# EAGLE design Shied Array Sensor (EAGLE 8.6.3)
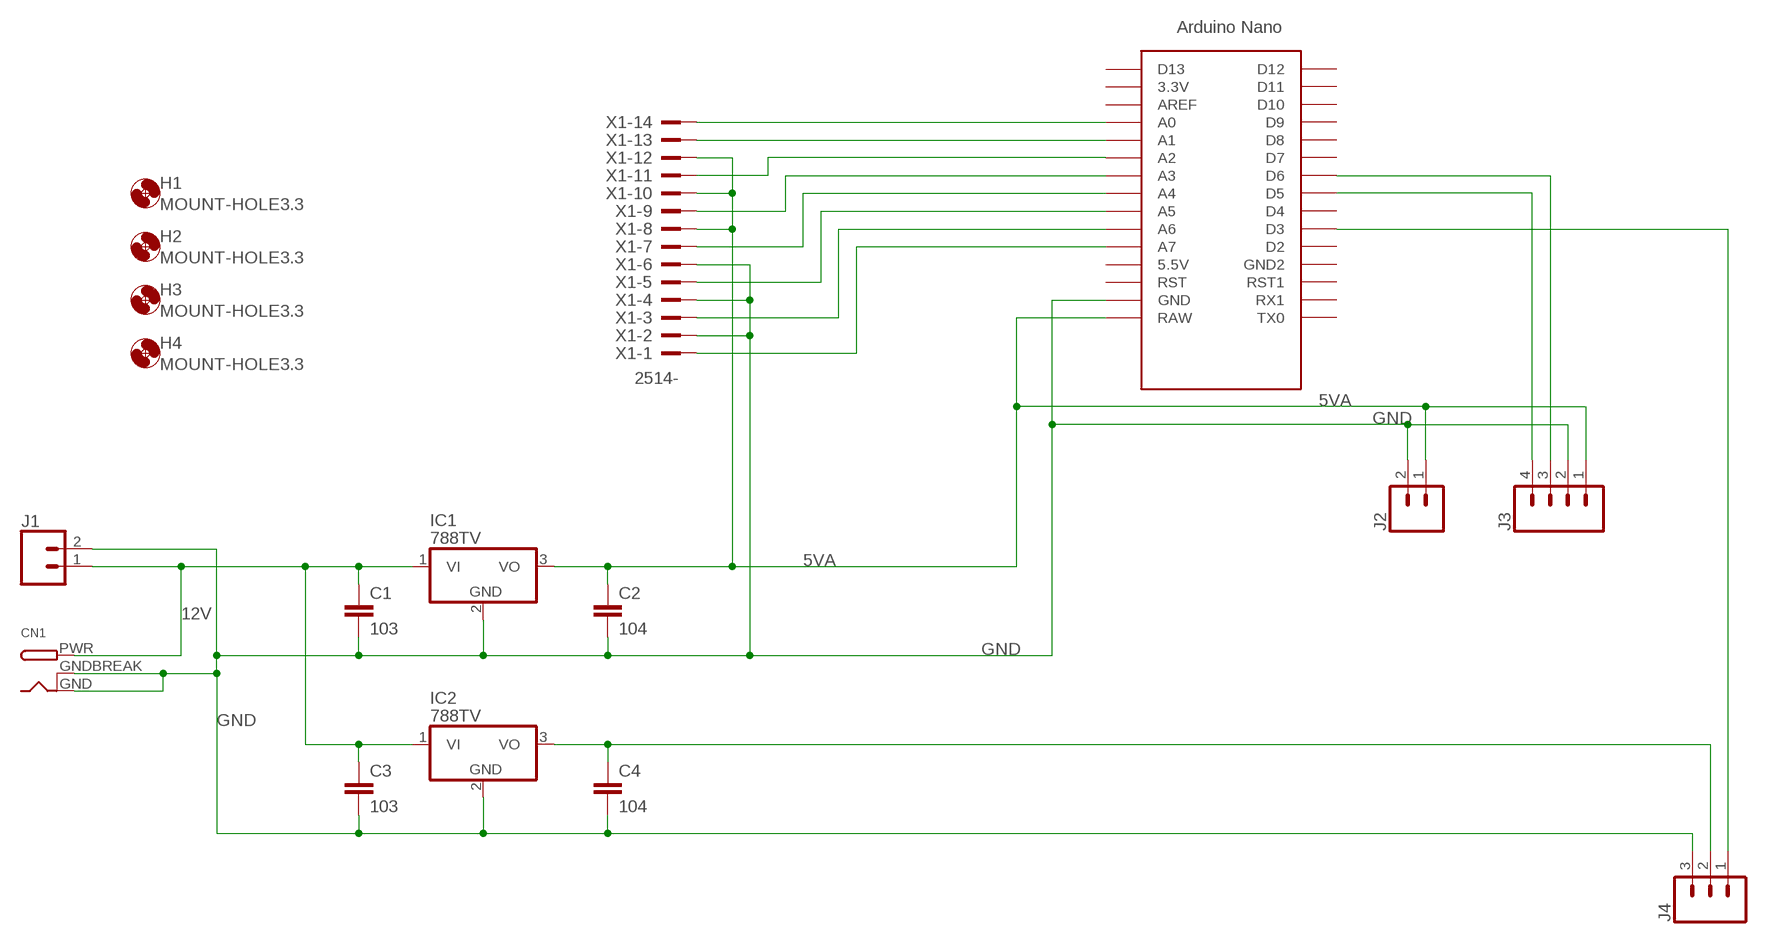
[diagram p0: schematic, sheet 1]

## Parts
C1  103  C-EU050-024X044  [C050-024X044]
C2  104  C-EU050-024X044  [C050-024X044]
C3  103  C-EU050-024X044  [C050-024X044]
C4  104  C-EU050-024X044  [C050-024X044]
CN1  DCBARRELPTH  [DCJACK_2MM_PTH]
H1  MOUNT-HOLE3.3  [3,3]
H2  MOUNT-HOLE3.3  [3,3]
H3  MOUNT-HOLE3.3  [3,3]
H4  MOUNT-HOLE3.3  [3,3]
IC1  788TV  [TO220V]
IC2  788TV  [TO220V]
J1  CONN_023.5MM_LOCK  [SCREWTERMINAL-3.5MM-2_LOCK]
J2  CONN_023.5MM_LOCK  [SCREWTERMINAL-3.5MM-2_LOCK]
J3  CONN_04LONGPADS  [1X04_LONGPADS]
J4  CONN_03LONGPADS  [1X03_LONGPADS]
U$1  NANO  [NANO]
X1  2514-  [PAK100/2500-14]

## Nets
5VA: C2.1 IC1.3(VO) J2.1 J3.1 U$1.RAW X1.8 X1.10 X1.12
12V: C1.1 C3.1 CN1.PWR IC1.1(VI) IC2.1(VI) J1.1
GND: C1.2 C2.2 C3.2 C4.2 CN1.GND CN1.GNDBREAK IC1.2(GND) IC2.2(GND) J1.2 J2.2 J3.2 J4.3 U$1.GND X1.2 X1.4 X1.6
N$1: U$1.A0 X1.14
N$2: U$1.A1 X1.13
N$3: U$1.A2 X1.11
N$4: U$1.A3 X1.9
N$5: U$1.A4 X1.7
N$6: U$1.A5 X1.5
N$7: U$1.A6 X1.3
N$8: U$1.A7 X1.1
N$9: J3.4 U$1.D5
N$10: C4.1 IC2.3(VO) J4.2
N$11: J3.3 U$1.D6
N$13: J4.1 U$1.D3
Unconnected: U$1.3.3V U$1.5V(5.5V) U$1.AREF U$1.D2 U$1.D4 U$1.D7 U$1.D8 U$1.D9 U$1.D10 U$1.D11 U$1.D12 U$1.D13 U$1.GND1(GND2) U$1.ICSP1 U$1.ICSP2 U$1.ICSP3 U$1.ICSP4 U$1.ICSP5 U$1.ICSP6 U$1.RST U$1.RST1 U$1.RX1 U$1.TX0

## Library data of the parts
C1-C4 = rcl:C-EU: CAPACITOR, European symbol; SPICEPREFIX: C
CN1 = adafruit:DCBARREL: 2.0mm DC Barrel Jack DCJACK_2MM_PTH - Through Hole Jack (4UConnector: 05537)
H1-H4 = holes:MOUNT-HOLE: MOUNTING HOLE with drill center marker
IC1 IC2 = linear:78*: Positive VOLTAGE REGULATOR Source: http://cache.national.com/ds/LM/LM78L05.pdf http://www.fairchildsemi.com/ds/LM/LM7805.pdf
J1 J2 = SparkFun-Connectors:CONN_02: Multi connection point. Often used as Generic Header-pin footprint for 0.1 inch spaced/style header connections On any of the 0.1 inch spaced packages, you can populate with these: Break Away Headers - Straight <https://www.sparkfun.com/products/116> (PRT-00116) Break Away Male Headers - Right Angle <https://www.sparkfun.com/products/553> (PRT-00553) Female Headers <https://www.sparkfun.com/products/115> (PRT-00115) Break Away Headers - Machine Pin <https://www.sparkfun.com/products/117> (PRT-00117) Break Away Female Headers - Swiss Machine Pin <https://www.sparkfun.com/products/743> (PRT-00743) For SCREWTERMINALS and SPRING TERMINALS visit here: Screw Terimnals on SparkFun.com <https://www.sparkfun.com/search/results?term=Screw+Terminals> (5mm/3.5mm/2.54mm spacing) This device is also useful as a general connection point to wire up your design to another part of your project. Our various solder wires solder well into these plated through hole pads. Hook-Up Wire - Assortment (Stranded, 22 AWG) <https://www.sparkfun.com/products/11375> (PRT-11375) Hook-Up Wire - Assortment (Solid Core, 22 AWG) <https://www.sparkfun.com/products/11367> (PRT-11367) View the entire wire category on our website here <https://www.sparkfun.com/categories/141> Special notes: Molex polarized connector foot print use with: PRT-08233 with associated crimp pins and housings. 2.54_SCREWTERM for use with PRT-10571. 3.5mm Screw Terminal footprints for PRT-08084 5mm Screw Terminal footprints for use with PRT-08432; PROD_ID: CONN-08399
J3 = SparkFun-Connectors:CONN_04: Multi connection point. Often used as Generic Header-pin footprint for 0.1 inch spaced/style header connections On any of the 0.1 inch spaced packages, you can populate with these: Break Away Headers - Straight <https://www.sparkfun.com/products/116> (PRT-00116) Break Away Male Headers - Right Angle <https://www.sparkfun.com/products/553> (PRT-00553) Female Headers <https://www.sparkfun.com/products/115> (PRT-00115) Break Away Headers - Machine Pin <https://www.sparkfun.com/products/117> (PRT-00117) Break Away Female Headers - Swiss Machine Pin <https://www.sparkfun.com/products/743> (PRT-00743) For SCREWTERMINALS and SPRING TERMINALS visit here: Screw Terimnals on SparkFun.com <https://www.sparkfun.com/search/results?term=Screw+Terminals> (5mm/3.5mm/2.54mm spacing) This device is also useful as a general connection point to wire up your design to another part of your project. Our various solder wires solder well into these plated through hole pads. Hook-Up Wire - Assortment (Stranded, 22 AWG) <https://www.sparkfun.com/products/11375> (PRT-11375) Hook-Up Wire - Assortment (Solid Core, 22 AWG) <https://www.sparkfun.com/products/11367> (PRT-11367) View the entire wire category on our website here <https://www.sparkfun.com/categories/141> Special notes: Molex polarized connector foot print use with SKU : PRT-08231 with associated crimp pins and housings. 1MM SMD Version SKU: PRT-10208; PROD_ID: CONN-09696
J4 = SparkFun-Connectors:CONN_03: Multi connection point. Often used as Generic Header-pin footprint for 0.1 inch spaced/style header connections On any of the 0.1 inch spaced packages, you can populate with these: Break Away Headers - Straight <https://www.sparkfun.com/products/116> (PRT-00116) Break Away Male Headers - Right Angle <https://www.sparkfun.com/products/553> (PRT-00553) Female Headers <https://www.sparkfun.com/products/115> (PRT-00115) Break Away Headers - Machine Pin <https://www.sparkfun.com/products/117> (PRT-00117) Break Away Female Headers - Swiss Machine Pin <https://www.sparkfun.com/products/743> (PRT-00743) Stackable Header - 3 Pin (Female, 0.1") <https://www.sparkfun.com/products/13875> (PRT-13875) For SCREWTERMINALS and SPRING TERMINALS visit here: Screw Terimnals on SparkFun.com <https://www.sparkfun.com/search/results?term=Screw+Terminals> (5mm/3.5mm/2.54mm spacing) This device is also useful as a general connection point to wire up your design to another part of your project. Our various solder wires solder well into these plated through hole pads. Hook-Up Wire - Assortment (Stranded, 22 AWG) <https://www.sparkfun.com/products/11375> (PRT-11375) Hook-Up Wire - Assortment (Solid Core, 22 AWG) <https://www.sparkfun.com/products/11367> (PRT-11367) View the entire wire category on our website here <https://www.sparkfun.com/categories/141> Special notes: Molex polarized connector foot print use with SKU : PRT-08232 with associated crimp pins and housings.
U$1 = Arduino-clone:NANO: Arduino Nano
X1 = con-3m:2514-: 3M (TM) Pak 100 4-Wall Header Source: 3M; OC_FARNELL: unknown; OC_NEWARK: unknown

## Board
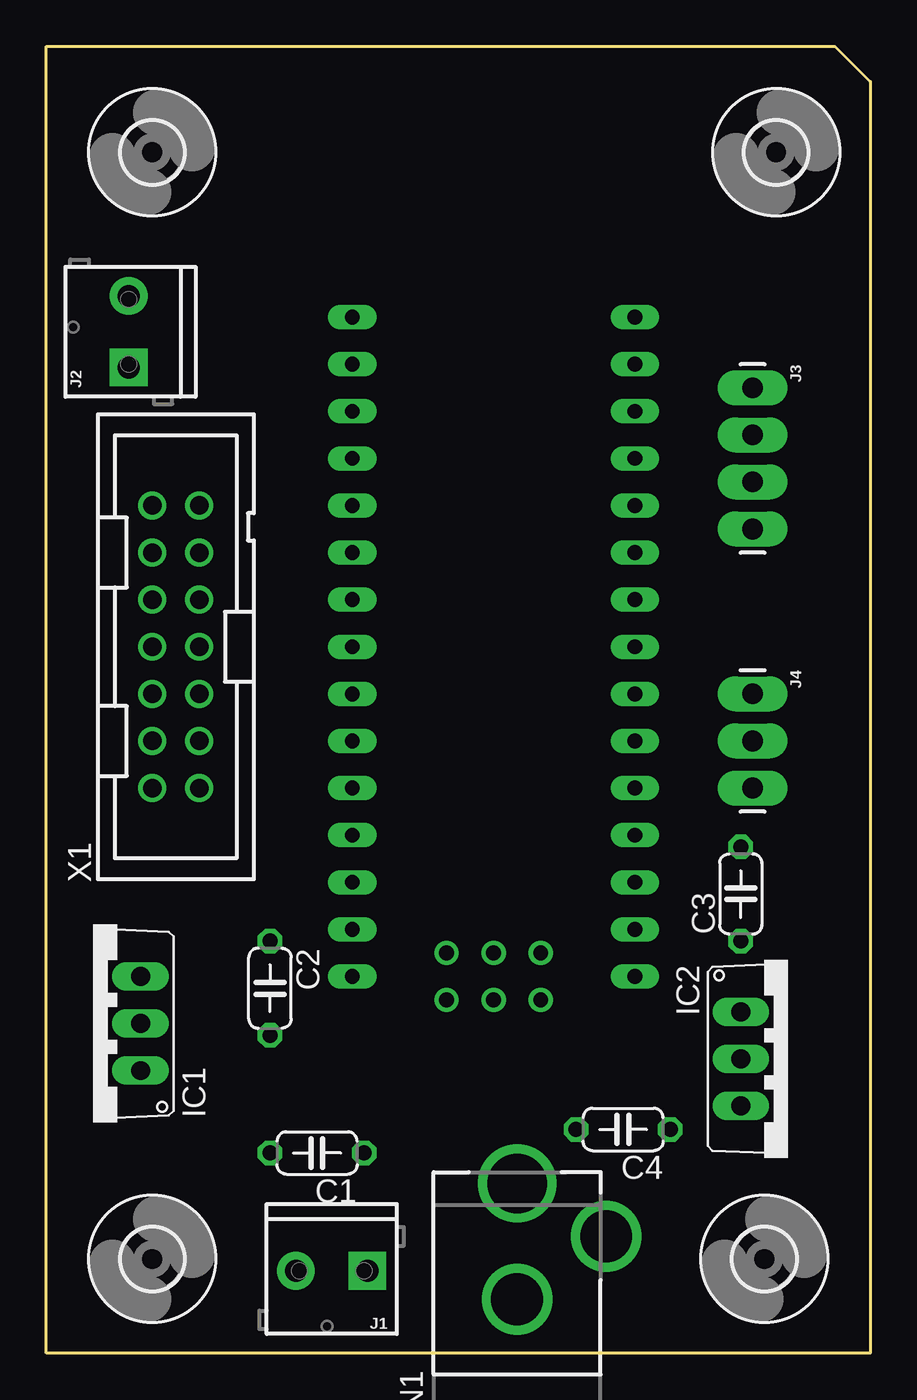
[diagram p1: board, top side]
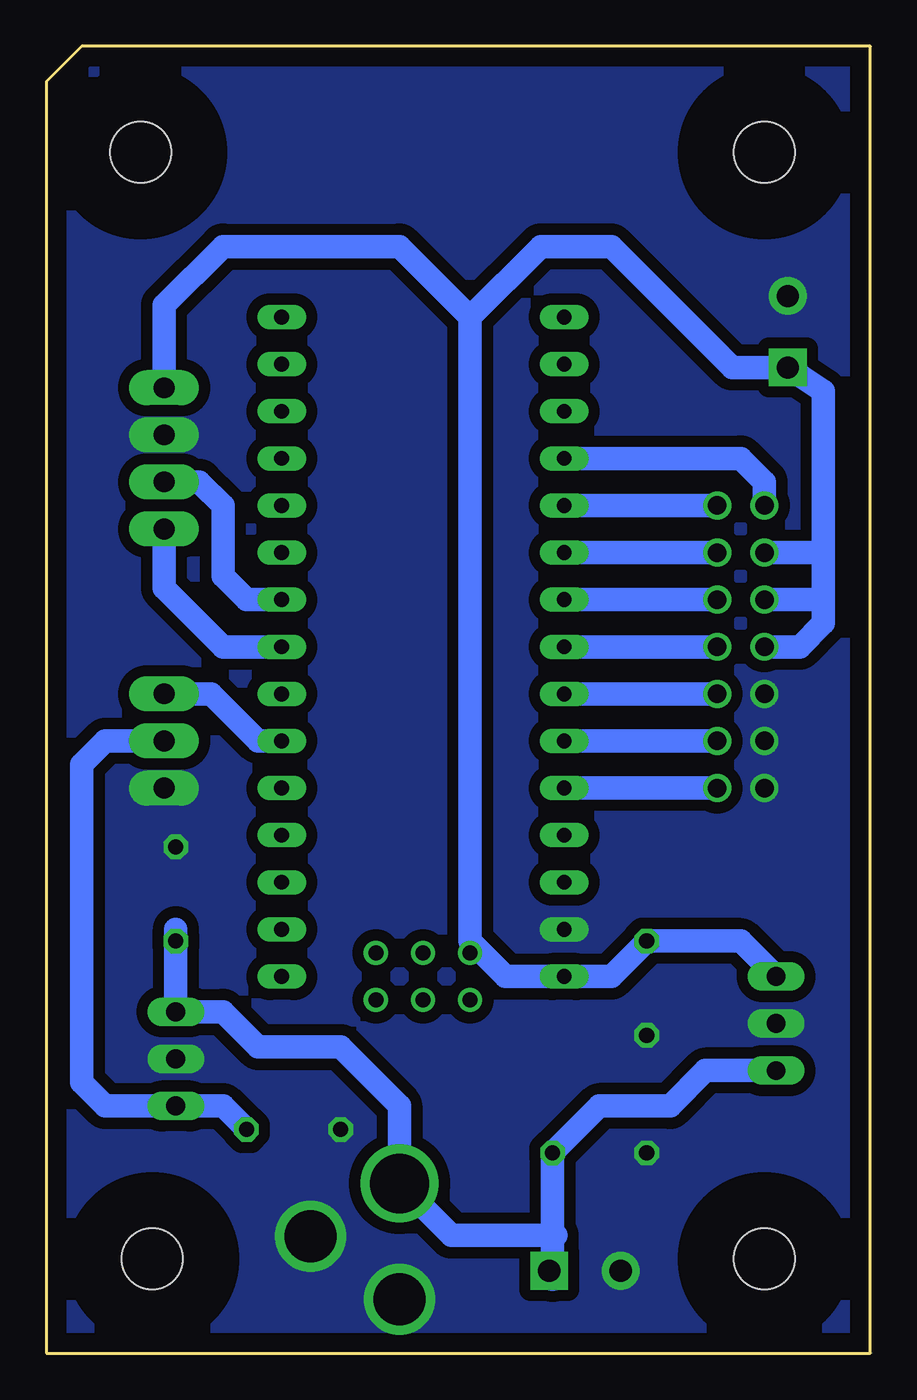
[diagram p2: board, bottom side, seen from below]

Size 44.45 x 70.48 mm. Coordinates in mm from the lower left corner, seen from the top.
Outline: 0,0 0,70.48 42.54,70.48 44.45,68.58 44.45,0 0,0
Copper layers (1*16): Top 0.035mm / dielectric 1.5mm / Bottom 0.035mm
Design rules "default": minimum track width 6mil, minimum drill 0.35mm, track to track 6mil, track to pad 6mil, pad to pad 6mil, via to via 6mil, smd to smd 6mil, copper to edge 40mil, drill to drill 6mil, minimum pad ring 10mil, minimum via ring 8mil, stop-mask expansion 4mil, vias tented up to drill 0mil, thermal gap 10mil

### Footprints (pad centres in the part's own frame; a part is rotated, then mirrored left to right if it is on the bottom)
C050-024X044 = drill 0.813 octagon: 1 -2.54,0; 2 2.54,0
DCJACK_2MM_PTH = drill 2.8: GND 0,7.35; GNDBREAK 4.8,10.75 | drill 3.2: PWR 0,13.6
3,3 = hole 3.3: 0,0
TO220V = drill 1.016 long: 1 -2.54,-2.54; 2 0,-2.54; 3 2.54,-2.54
SCREWTERMINAL-3.5MM-2_LOCK = drill 1.2 pad 2.032 square: 1 -0.178,0 | drill 1.2 pad 2.032: 2 3.678,0
1X04_LONGPADS = drill 1.118 pad 1.88 long: 1 0,0; 2 2.54,0; 3 5.08,0; 4 7.62,0
1X03_LONGPADS = drill 1.118 pad 1.88 long: 1 0,0; 2 2.54,0; 3 5.08,0
NANO = drill 0.8 long: 3.3V -10.16,24.13; 5V -10.16,-1.27; A0 -10.16,19.05; A1 -10.16,16.51; A2 -10.16,13.97; A3 -10.16,11.43; A4 -10.16,8.89; A5 -10.16,6.35; A6 -10.16,3.81; A7 -10.16,1.27; AREF -10.16,21.59; D2 5.08,1.27; D3 5.08,3.81; D4 5.08,6.35; D5 5.08,8.89; D6 5.08,11.43; D7 5.08,13.97; D8 5.08,16.51; D9 5.08,19.05; D10 5.08,21.59; D11 5.08,24.13; D12 5.08,26.67; D13 -10.16,26.67; GND -10.16,-6.35; GND1 5.08,-1.27; RAW -10.16,-8.89; RST -10.16,-3.81; RST1 5.08,-3.81; RX1 5.08,-6.35; TX0 5.08,-8.89 | drill 0.8: ICSP1 -5.08,-10.16; ICSP2 -5.08,-7.62; ICSP3 -2.54,-10.16; ICSP4 -2.54,-7.62; ICSP5 0,-10.16; ICSP6 0,-7.62
PAK100/2500-14 = drill 1 pad 1.422: 1 -7.62,-1.27; 2 -7.62,1.27; 3 -5.08,-1.27; 4 -5.08,1.27; 5 -2.54,-1.27; 6 -2.54,1.27; 7 0,-1.27; 8 0,1.27; 9 2.54,-1.27; 10 2.54,1.27; 11 5.08,-1.27; 12 5.08,1.27; 13 7.62,-1.27; 14 7.62,1.27

### Placement (x,y rotation side)
C1  14.61,10.79 180 top
C2  12.07,19.68 270 top
C3  37.46,24.77 90 top
C4  31.11,12.07 180 top
CN1  25.4,-4.45 0 top
H1  5.71,64.77 0 top
H2  39.37,64.77 0 top
H3  38.73,5.08 0 top
H4  5.71,5.08 0 top
IC1  2.54,17.78 90 top
IC2  40,15.88 270 top
J1  17.14,4.45 180 top
J2  4.45,53.34 90 top
J3  38.1,52.07 270 top
J4  38.1,35.56 270 top
U$1  26.67,29.21 0 top
X1  6.99,38.1 90 top

### Tracks (layer width: path | path; a pad name or v marks a point on that pad's centre or on a via)
5VA
  Bottom 1.27: 21.59,55.88 17.78,59.69 13.97,59.69 7.44,53.16 J2.1 2.54,51.89 2.54,43.18 | 21.59,55.88 21.59,22.23 19.68,20.32 U$1.RAW 13.97,20.32 C2.1 6.99,22.23 IC1.3 | J3.1 38.1,56.51 34.92,59.69 25.4,59.69 21.59,55.88 | 2.54,43.18 2.54,40.64 | 2.54,40.64 2.54,39.37 3.81,38.1 X1.8 | X1.10 2.54,40.64 | X1.12 2.54,43.18
12V
  Bottom 1.27: 17.14,6.35 22.59,6.35 CN1.PWR 25.4,13.34 28.57,16.51 33.02,16.51 34.92,18.41 IC2.1 C3.1 37.46,22.86 | 17.14,6.35 16.97,6.35 | IC1.1 8.89,15.24 10.79,13.34 14.61,13.34 C1.1 17.14,6.35 | 17.14,6.35 17.14,3.99 J1.1
GND
  pour Bottom (isolate 0.61, no thermals): 0,0 44.45,0 44.45,68.58 42.54,70.48 0,70.48
N$1
  Bottom 1.27: X1.14 5.71,46.99 6.99,48.26 U$1.A0
N$2
  Bottom 1.27: X1.13 U$1.A1
N$3
  Bottom 1.27: X1.11 U$1.A2
N$4
  Bottom 1.27: U$1.A3 X1.9
N$5
  Bottom 1.27: X1.7 U$1.A4
N$6
  Bottom 1.27: X1.5 U$1.A5
N$7
  Bottom 1.27: X1.3 U$1.A6
N$8
  Bottom 1.27: X1.1 U$1.A7
N$9
  Bottom 1.27: J3.4 38.1,41.27 34.92,38.1 U$1.D5
N$10
  Bottom 1.27: C4.1 34.92,13.34 IC2.3 41.27,13.34 42.54,14.61 42.54,31.75 41.27,33.02 J4.2
N$11
  Bottom 1.27: U$1.D6 33.65,40.64 34.92,41.91 34.92,45.72 36.2,46.99 J3.3
N$13
  Bottom 1.27: J4.1 35.56,35.56 33.02,33.02 U$1.D3